# Altium schematic sheet Peripherals.SchDoc
size A4
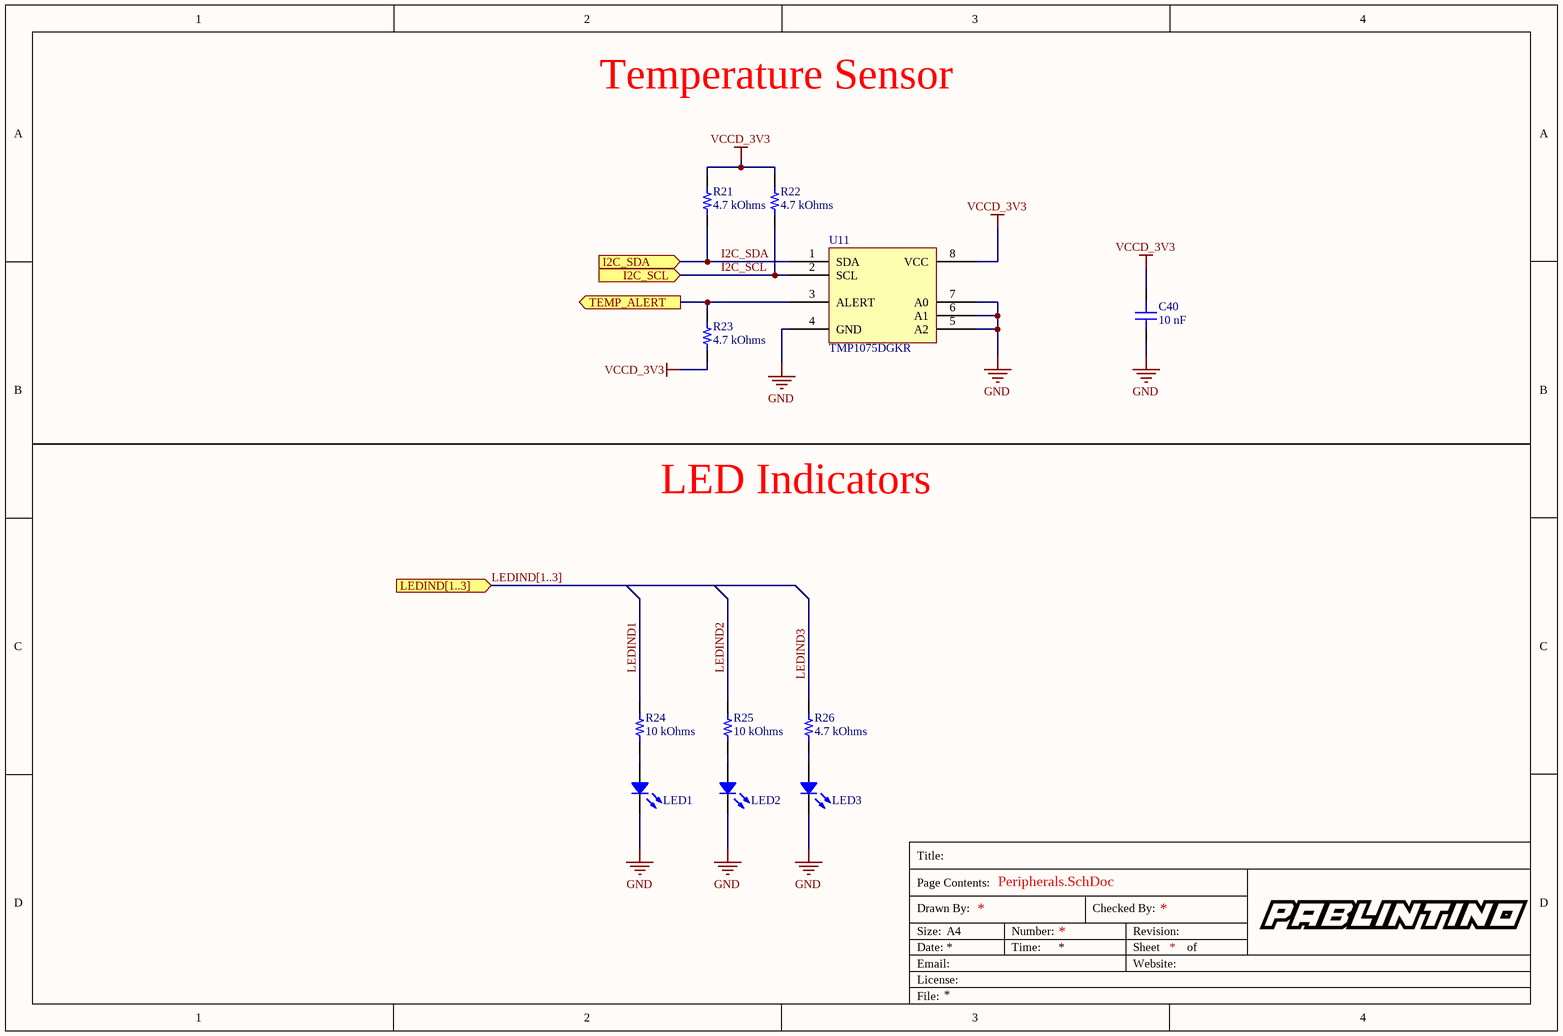
[diagram p0: Peripherals.SchDoc]

## Parts
C40  10 nF  [CAP 0603_1608]
LED1  APTD1608LZGCK  [LED 0603_1608 GREEN]  (value not drawn)
LED2  APTD1608LZGCK  [LED 0603_1608 GREEN]  (value not drawn)
LED3  APTD1608LSECK  [LED 0603_1608 RED]  (value not drawn)
R21  4.7 kOhms  [RES 0603_1608]
R22  4.7 kOhms  [RES 0603_1608]
R23  4.7 kOhms  [RES 0603_1608]
R24  10 kOhms  [RES 0603_1608]
R25  10 kOhms  [RES 0603_1608]
R26  4.7 kOhms  [RES 0603_1608]
U11  TMP1075DGKR  [TI VSSOP-8 DGK]

## Ports
I2C_SCL (in), I2C_SDA (in), LEDIND[1..3] (in), TEMP_ALERT (out)

## Nets
GND: C40.2 LED1.2 LED2.2 LED3.2 U11.4(GND) U11.5(A2) U11.6(A1) U11.7(A0)
VCCD_3V3: C40.1 R21.2 R22.2 R23.1 U11.8(VCC)
I2C_SCL: R22.1 U11.2(SCL) ; port I2C_SCL
I2C_SDA: R21.1 U11.1(SDA) ; port I2C_SDA
LEDIND1: R24.1
LEDIND2: R25.1
LEDIND3: R26.1
TEMP_ALERT: R23.2 U11.3(ALERT) ; port TEMP_ALERT
NetLED1_1: LED1.1 R24.2
NetLED2_1: LED2.1 R25.2
NetLED3_1: LED3.1 R26.2

## Buses and harness runs
bus LEDIND[1..3] = port LEDIND[1..3]

## Notes on the sheet
- Temperature Sensor
- LED Indicators
- Title:
- Drawn By:
- Page Contents:
- Checked By:
- Size:
- Date:
- File:
- License:
- Email:
- A4
- Number:
- Time:
- Revision:
- Sheet
- Website:
- of

## Library data of the parts
C40 = 0603YC103JAT2A: MLCC Ceramic 10 nF 16 V 5% Capacitor; Manufacturer: AVX; Voltage: 16 V; Type: capacitor_ceramic; Through Hole: 0; Part Number: 0603YC103JAT2A; Value: 10 nF; Tolerance: 5%; Composition: X7R; Created On: 02/09/2020 21:50:45; Updated On: 02/09/2020 21:52:04; Package: 0603 (1608 Metric)
LED1 LED2 = APTD1608LZGCK: SMD Low Current Green LED; Manufacturer: Kingbright; Gain Bandwith Product: 2.65 V; Input Type: dome; Amplifier Type: clear; Slew Rate: 515 nm; Voltage Supplies: 2 mA; Input Offset Voltage: 0.8 mm x 1.2 mm; Type: led_indicator; Through Hole: 0; Part Number: APTD1608LZGCK; Output Type: green; Created On: 28/07/2020 18:40:12; Updated On: 28/07/2020 18:43:35; Package: 0603 (1608 Metric)
LED3 = APTD1608LSECK: SMD Low Current Red LED; Manufacturer: Kingbright; Gain Bandwith Product: 1.8 V; Input Type: dome; Amplifier Type: clear; Slew Rate: 625 nm; Voltage Supplies: 2 mA; Input Offset Voltage: 0.8 mm x 1.2 mm; Type: led_indicator; Through Hole: 0; Part Number: APTD1608LSECK; Output Type: red; Created On: 28/07/2020 18:43:03; Updated On: 28/07/2020 18:43:38; Package: 0603 (1608 Metric)
R21-R23 R26 = CRCW06034K70FKEAC: Thin Film Resistor 4.7 kOhms 1%; Manufacturer: Vishay / Dale; Power Max: 100 mW; Through Hole: 0; Part Number: CRCW06034K70FKEAC; Value: 4.7 kOhms; Tolerance: 1%; Created On: 28/07/2020 21:42:19; Updated On: 28/07/2020 21:42:52; Type: resistor; Package: 0603 (1608 Metric)
R24 R25 = CRCW060310K0FKEAC: Thin Film Resistor 10 kOhms 1%; Manufacturer: Vishay / Dale; Power Max: 100 mW; Through Hole: 0; Part Number: CRCW060310K0FKEAC; Value: 10 kOhms; Tolerance: 1%; Created On: 22/07/2020 22:08:22; Updated On: 22/07/2020 22:09:01; Type: resistor; Package: 0603 (1608 Metric)
U11 = TMP1075DGKR: TMP1075 Temperature Sensor With I2C and SMBus Interface; Manufacturer: Texas Instruments; Proportional Gain: 0.0625 C; Supply Voltage: 1.7 V to 5.5 V; Through Hole: 0; Part Number: TMP1075DGKR; Input Magnitude: temperature; Output Type: I2C; Created On: 04/08/2020 19:51:22; Updated On: 04/08/2020 19:51:56; Type: transducer; Package: VSSOP-8